# EAGLE design scoreur (EAGLE 6.6.0)
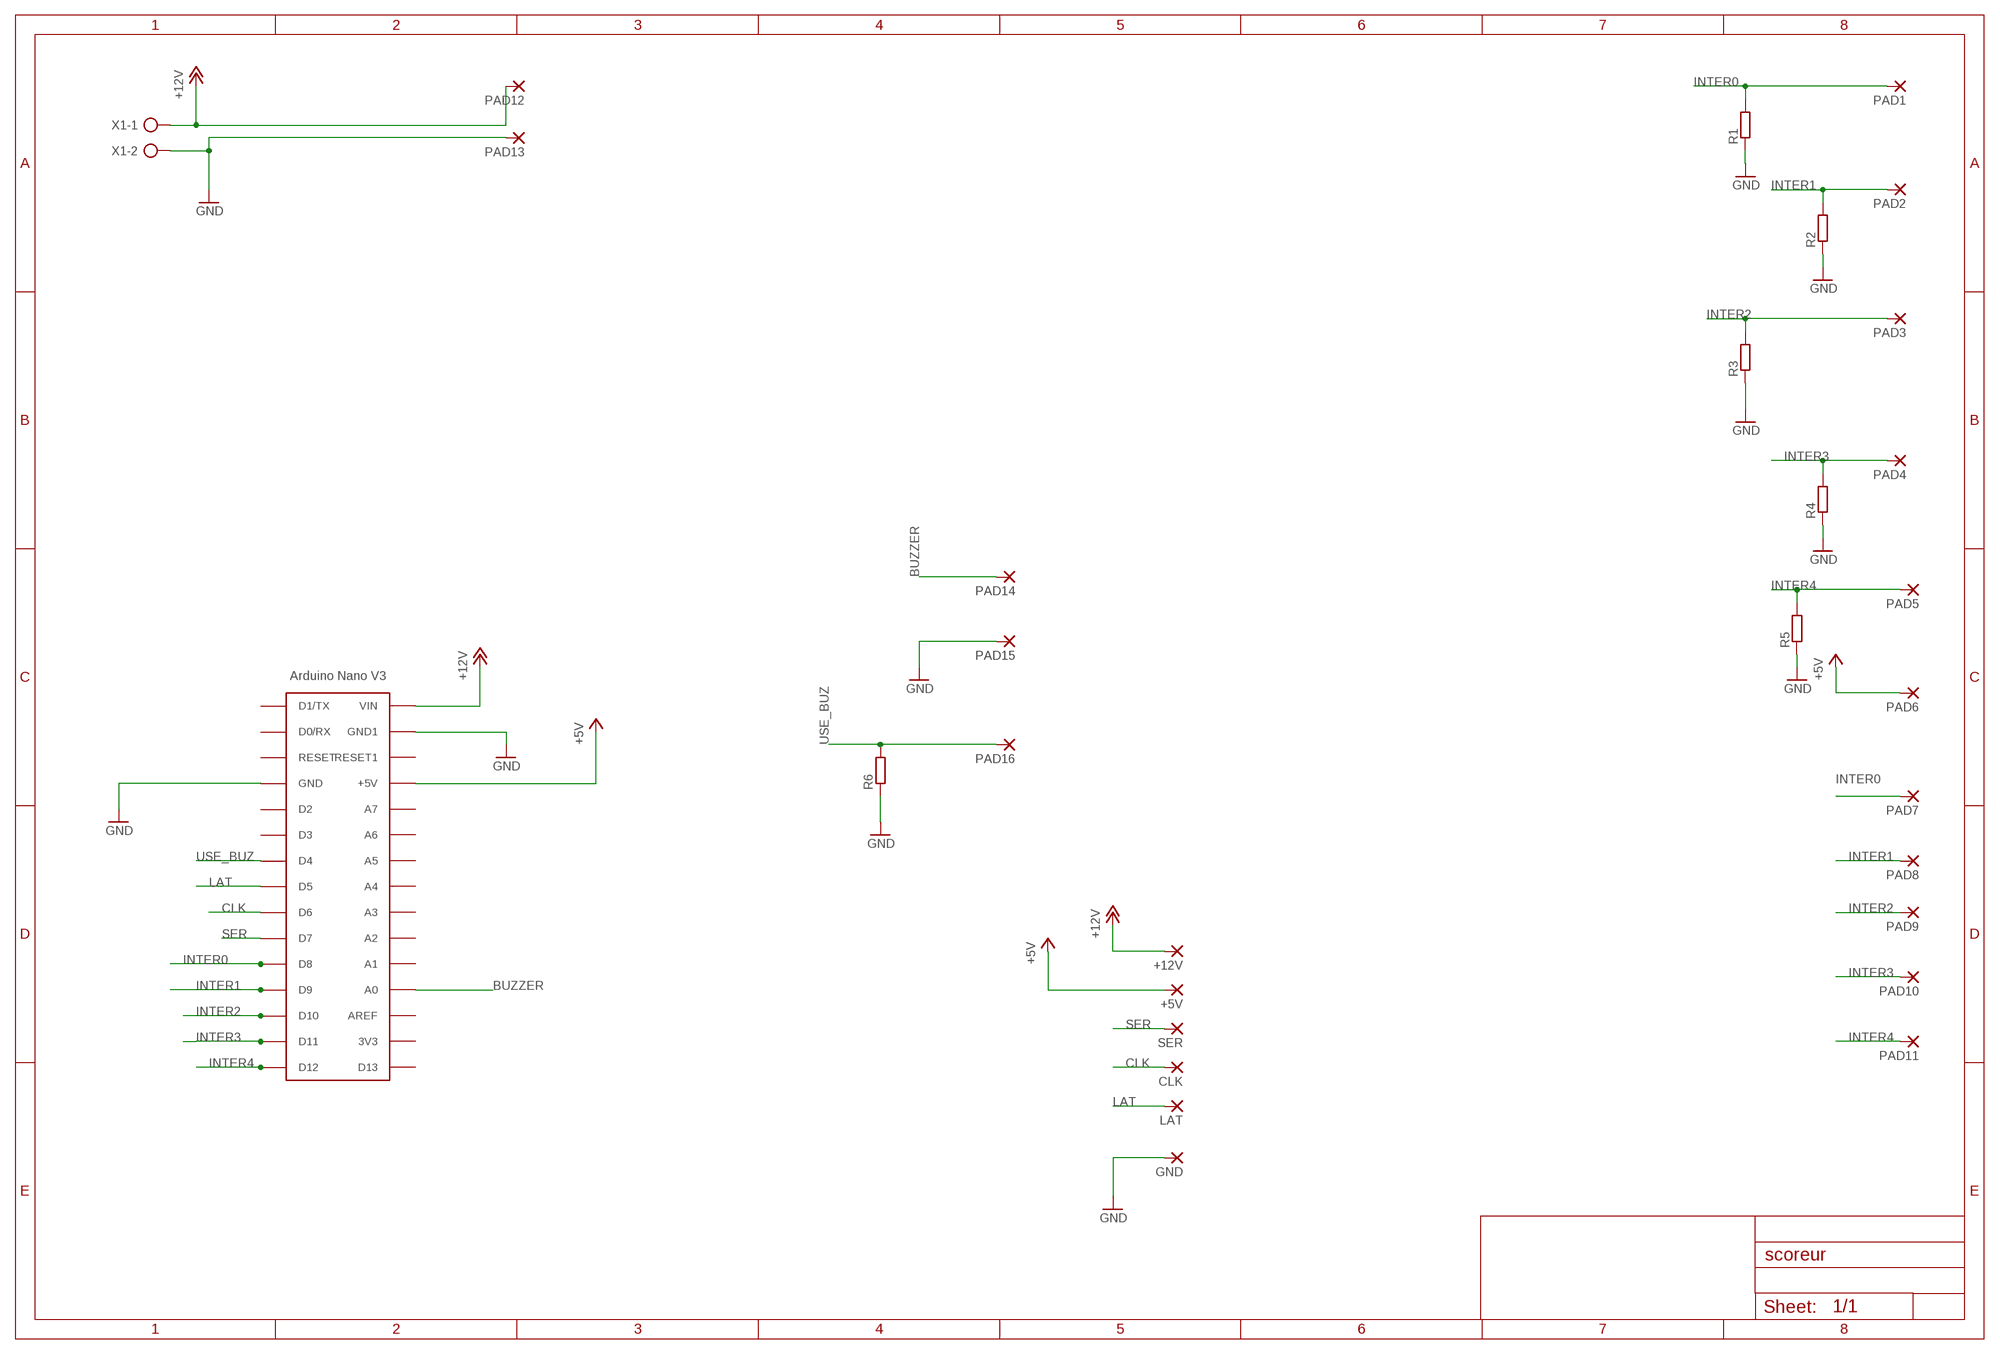
[diagram p0: schematic, sheet 1]

## Parts
+5V  SMD5  [SMD2,54-5,08]
+12V  SMD5  [SMD2,54-5,08]
CLK  SMD5  [SMD2,54-5,08]
GND  SMD5  [SMD2,54-5,08]
LAT  SMD5  [SMD2,54-5,08]
PAD1  SMD5  [SMD2,54-5,08]
PAD2  SMD5  [SMD2,54-5,08]
PAD3  SMD5  [SMD2,54-5,08]
PAD4  SMD5  [SMD2,54-5,08]
PAD5  SMD5  [SMD2,54-5,08]
PAD6  SMD5  [SMD2,54-5,08]
PAD7  SMD5  [SMD2,54-5,08]
PAD8  SMD5  [SMD2,54-5,08]
PAD9  SMD5  [SMD2,54-5,08]
PAD10  SMD5  [SMD2,54-5,08]
PAD11  SMD5  [SMD2,54-5,08]
PAD12  SMD5  [SMD2,54-5,08]
PAD13  SMD5  [SMD2,54-5,08]
PAD14  SMD5  [SMD2,54-5,08]
PAD15  SMD5  [SMD2,54-5,08]
PAD16  SMD5  [SMD2,54-5,08]
R1  R-EU_R1206  [R1206]
R2  R-EU_R1206  [R1206]
R3  R-EU_R1206  [R1206]
R4  R-EU_R1206  [R1206]
R5  R-EU_R1206  [R1206]
R6  R-EU_R1206  [R1206]
SER  SMD5  [SMD2,54-5,08]
U$1  ARDUINONANO  [PDIP-32]
X1  AK500/2-H  [AK500/2-H]

## Nets
+5V: +5V.1(P) PAD6.1(P) U$1.+5V
+12V: +12V.1(P) PAD12.1(P) U$1.VIN X1.1
BUZZER: PAD14.1(P) U$1.A7(A0)
CLK: CLK.1(P) U$1.D6
GND: GND.1(P) PAD13.1(P) PAD15.1(P) R1.1 R2.1 R3.1 R4.1 R5.1 R6.1 U$1.GND U$1.GND1 X1.2
INTER0: PAD1.1(P) PAD7.1(P) R1.2 U$1.D8
INTER1: PAD2.1(P) PAD8.1(P) R2.2 U$1.D9
INTER2: PAD3.1(P) PAD9.1(P) R3.2 U$1.D10
INTER3: PAD4.1(P) PAD10.1(P) R4.2 U$1.D11
INTER4: PAD5.1(P) PAD11.1(P) R5.2 U$1.D12
LAT: LAT.1(P) U$1.D5
SER: SER.1(P) U$1.D7
USE_BUZ: PAD16.1(P) R6.2 U$1.D4
Unconnected: U$1.3V3 U$1.A0(A7) U$1.A1(A6) U$1.A2(A5) U$1.A3(A4) U$1.A4(A3) U$1.A5(A2) U$1.A6(A1) U$1.AREF U$1.D0/RX U$1.D1/TX U$1.D2 U$1.D3 U$1.D13 U$1.RESET U$1.RESET1

## Library data of the parts
+5V +12V CLK GND LAT PAD1-PAD16 SER = wirepad:SMD5: SMD PAD
R1-R6 = rcl:R-EU_: RESISTOR, European symbol
U$1 = CRE-Lib1:ARDUINONANO: Arduino Nano
X1 = con-ptr500:AK500/2-H: CONNECTOR Aug. 2004 / PTR Meßtechnik: Die Bezeichnung der Serie AK505 wurde geändert. Es handelt sich hierbei um AK500 in horizontaler Ausführung.; OC_FARNELL: unknown; OC_NEWARK: unknown

## Board
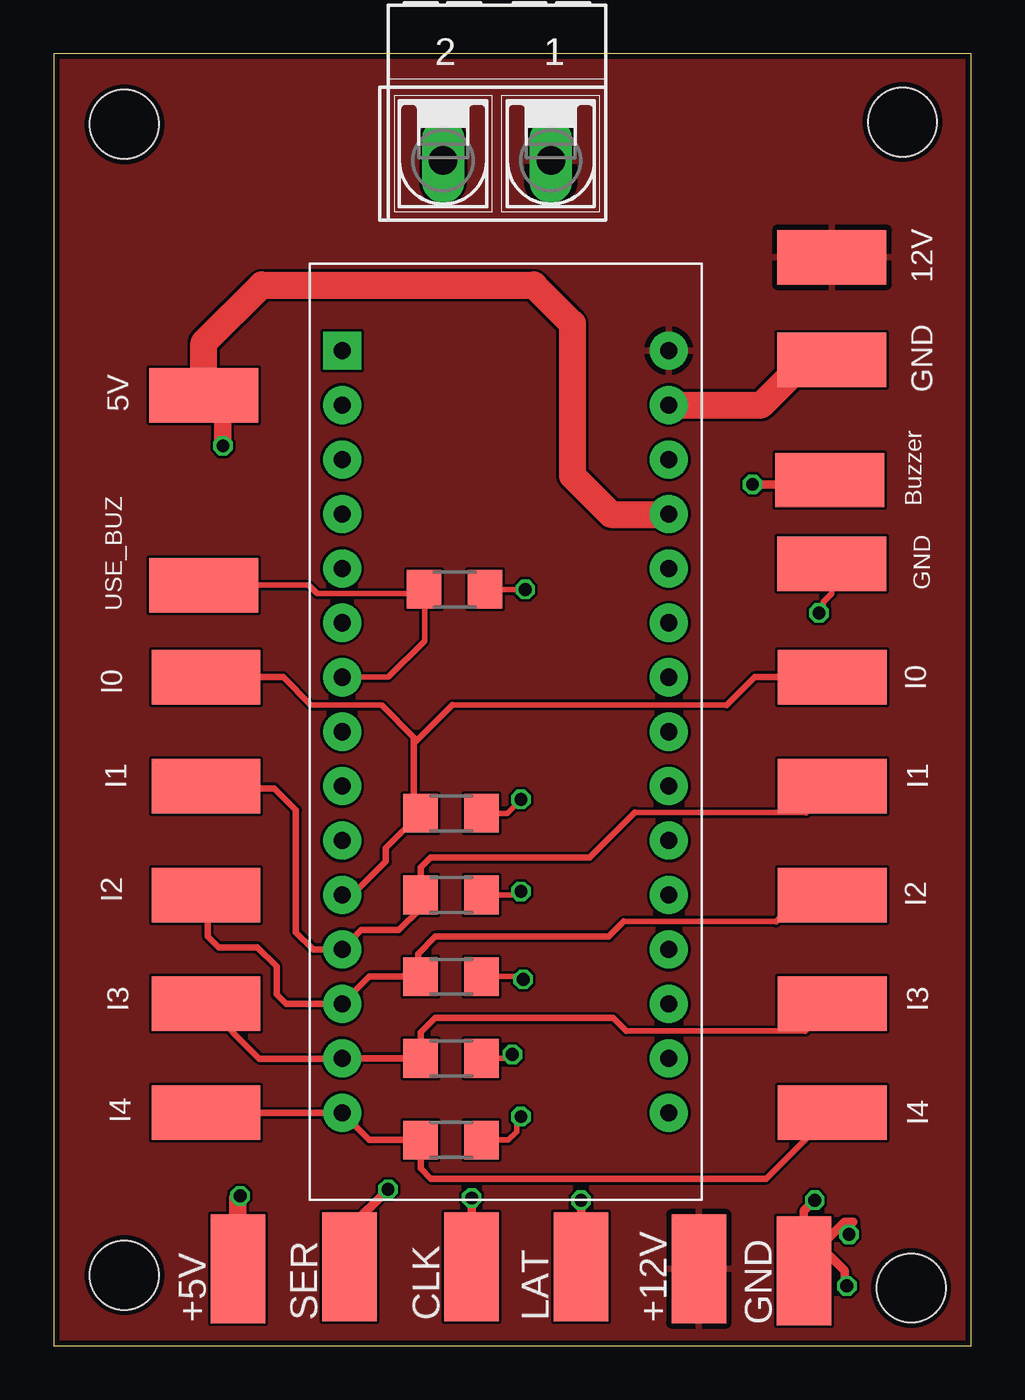
[diagram p1: board, top side]
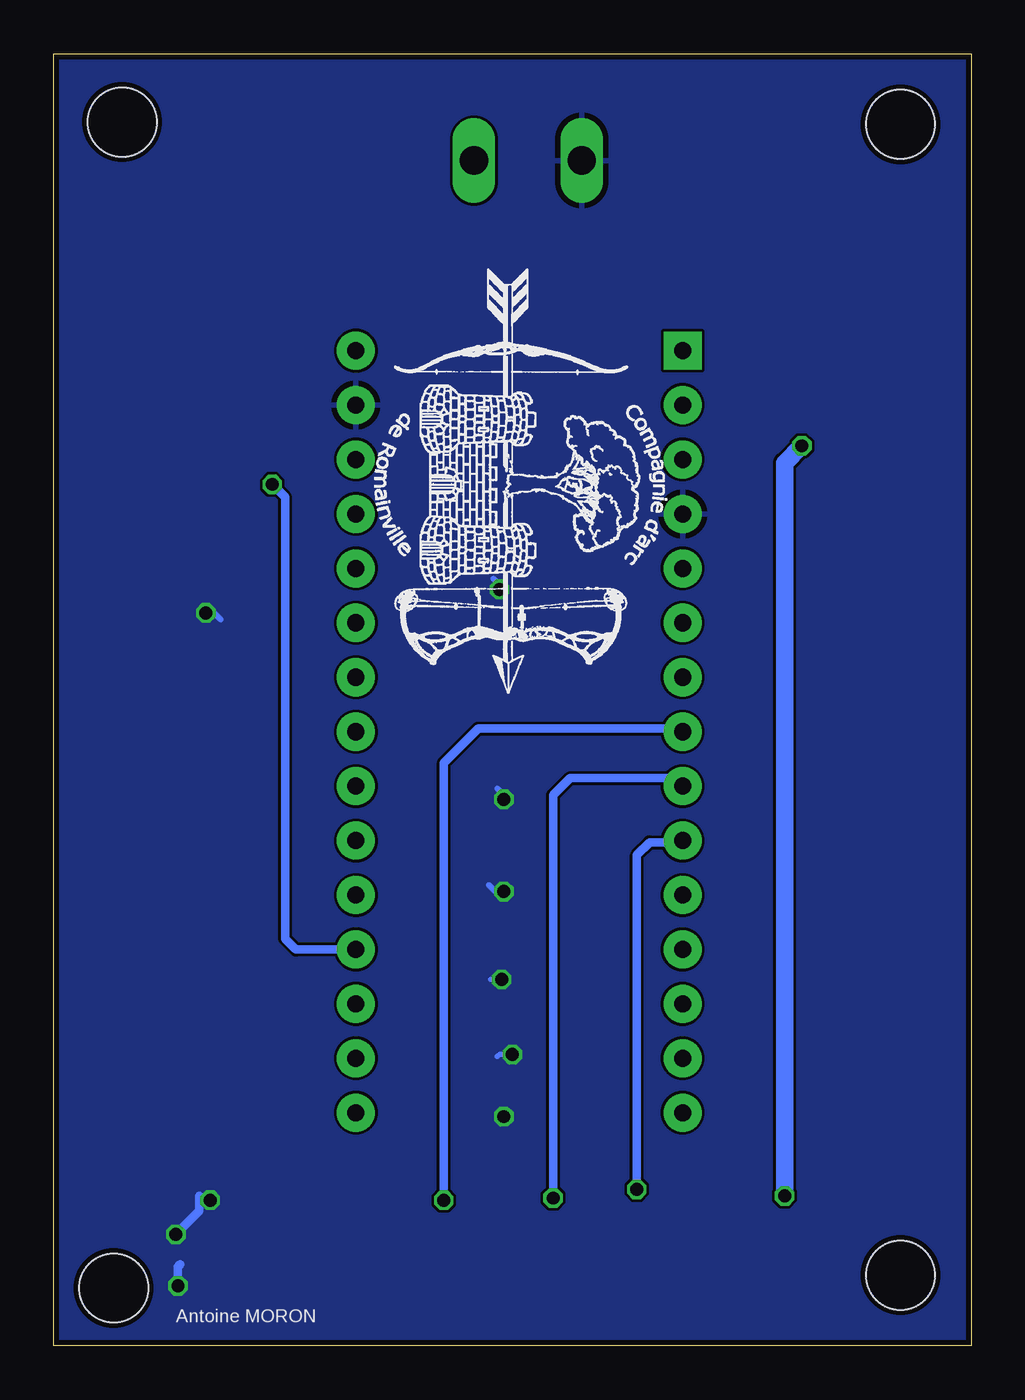
[diagram p2: board, bottom side, seen from below]

Size 42.8 x 60.3 mm. Coordinates in mm from the lower left corner, seen from the top.
Outline: 0,0 42.8,0 42.8,60.3 0,60.3 0,0
Copper layers (1*16): Top 0.035mm / dielectric 1.5mm / Bottom 0.035mm
Design rules "dirt_cheap_dirty_boards.v1": minimum track width 5mil, minimum drill 12mil, track to track 5mil, track to pad 5mil, pad to pad 5mil, via to via 5mil, smd to smd 0mil, copper to edge 10mil, drill to drill 10mil, minimum pad ring 10mil, minimum via ring 6mil, stop-mask expansion 2mil, vias tented up to drill 25mil, thermal gap 10mil
Holes 3.2 mm at 3.3,57 39.6,57.1 40,2.7 3.3,3.3

### Footprints (pad centres in the part's own frame; a part is rotated, then mirrored left to right if it is on the bottom)
SMD2,54-5,08 = smd 2.54 x 5.08: 1 0,0
R1206 = smd 1.6 x 1.803: 1 -1.422,0; 2 1.422,0
PDIP-32 = drill 0.8 pad 1.778: 3V3 15.24,-35.56; +5V 15.24,-10.16; A0 15.24,-12.7; A1 15.24,-15.24; A2 15.24,-17.78; A3 15.24,-20.32; A4 15.24,-22.86; A5 15.24,-25.4; A6 15.24,-27.94; A7 15.24,-30.48; AREF 15.24,-33.02; D0/RX 0,-5.08; D2 0,-12.7; D3 0,-15.24; D4 0,-17.78; D5 0,-20.32; D6 0,-22.86; D7 0,-25.4; D8 0,-27.94; D9 0,-30.48; D10 0,-33.02; D11 0,-35.56; D12 0,-38.1; D13 15.24,-38.1; GND 0,-10.16; GND1 15.24,-5.08; RESET 0,-7.62; RESET1 15.24,-7.62; VIN 15.24,-2.54 | drill 0.8 pad 1.778 square: D1/TX 0,-2.54
AK500/2-H = drill 1.321 long: 1 -2.515,0; 2 2.515,0

### Placement (x,y rotation side)
+5V  8.6,3.6 0 top
+12V  30.1,3.6 0 top
CLK  19.5,3.7 0 top
GND  35,3.5 0 top
LAT  24.6,3.7 0 top
PAD1  7.11,31.2 90 top
PAD2  7.11,26.12 90 top
PAD3  7.11,21.04 90 top
PAD4  7.11,15.96 90 top
PAD5  36.32,10.88 90 top
PAD6  7.01,44.35 90 top
PAD7  36.32,31.2 90 top
PAD8  36.32,26.12 90 top
PAD9  36.32,21.04 90 top
PAD10  36.32,15.96 90 top
PAD11  7.11,10.88 90 top
PAD12  36.3,50.8 90 top
PAD13  36.3,46 90 top
PAD14  36.2,40.4 90 top
PAD15  36.3,36.5 90 top
PAD16  7,35.5 90 top
R1  18.54,24.85 180 top
R2  18.54,21.04 180 top
R3  18.54,17.23 180 top
R4  18.54,13.42 180 top
R5  18.54,9.61 180 top
R6  18.7,35.3 180 top
SER  13.8,3.7 0 top
U$1  13.46,48.98 0 top
U$2  [LOGO]  28.4,50.6 270 bottom
X1  20.68,55.31 180 top

### Tracks (layer width: path | path; a pad name or v marks a point on that pad's centre or on a via)
+5V  (via drill 0.6)
  Top 0.813: +5V.1 8.6,6.9 v8.7,7 | v7.9,42 7.9,44.6 7.8,44.7 7.36,44.7 PAD6.1
  Top 1.27: PAD6.1 7.01,46.81 9.7,49.5 22.4,49.5 24.2,47.7 24.2,40.6 26,38.8 28.68,38.8 U$1.+5V
  Bottom 0.813: v8.7,7 8.7,41.2 v7.9,42
+12V
  pour Top: 0.1,61.9 46,62.2 45.7,-0.1 0,-0.1
BUZZER  (via drill 0.6)
  Top 0.406: v32.6,40.2 36,40.2 PAD14.1
  Bottom 0.406: U$1.A7 31.5,18.5 32,19 32,39.6 v32.6,40.2
CLK  (via drill 0.6)
  Top 0.406: CLK.1 v19.5,6.9
  Bottom 0.406: v19.5,6.9 19.5,25.7 18.7,26.5 13.84,26.5 U$1.D6
GND  (via drill 0.6)
  Top 0.254: R6.1 v22,35.3 | R1.1 21.15,24.85 v21.8,25.5 | R2.1 21.64,21.04 v21.8,21.2 | R3.1 21.77,17.23 v21.9,17.1 | R4.1 21.22,13.42 v21.4,13.6 | PAD15.1 36.3,35.1 35.9,34.7 35.9,34.4 v35.7,34.2 | R5.1 21.21,9.61 21.6,10 21.6,10.5 v21.8,10.7
  Top 0.406: GND.1 35,6.3 v35.5,6.8 | v37.1,5.2 37.1,5.6 37.3,5.8 36.9,5.8 35.3,4.2 36.2,4.2 36.9,3.5 36.9,2.9 v37,2.8
  Top 1.27: U$1.GND1 33,43.9 34.7,45.6 35.9,45.6 PAD13.1
  Bottom 0.254: v22,35.3 22,35.5 22.3,35.8 | v21.8,25.5 21.8,25.7 22.1,26 | v21.8,21.2 22.2,21.2 22.5,21.5 | v21.9,17.1 22.4,17.1 | v21.4,13.6 22,13.6 22.1,13.5 | v35.7,34.2 35.3,34.2 35,33.9 | v21.8,10.7 21.7,10.8
  Bottom 0.406: v35.5,6.8 35.8,6.8 36,7 36,6.3 v37.1,5.2 | v37,2.8 37,3.7 36.9,3.8
  pour Bottom: 0.2,60.4 43.5,60.4 43.5,-1.9 0,-1.9 0,60.4
INTER0
  Top 0.254: 10.7,31.2 12,29.9 15.3,29.9 16.8,28.4 | 31.4,29.9 18.6,29.9
  Top 0.305: PAD1.1 10.7,31.2 | 16.8,28.4 16.8,28.1 | 16.8,28.1 16.8,25.17 R1.2 15.5,23.23 15.5,22.6 13.94,21.04 U$1.D8 | PAD7.1 32.7,31.2 31.4,29.9 | 18.6,29.9 16.8,28.1
INTER1
  Top 0.254: 27.1,24.9 35.1,24.9
  Top 0.305: PAD2.1 7.23,26 10.3,26 11.3,25 11.3,19.3 12.1,18.5 U$1.D9 14.36,19.4 16.1,19.4 17.12,20.42 R2.2 17.12,22.32 17.6,22.8 25,22.8 27.1,24.9 | 35.1,24.9 PAD8.1
INTER2
  Top 0.254: 33.7,19.8 26.6,19.8
  Top 0.305: PAD9.1 34.94,21.04 33.7,19.8 | 26.6,19.8 25.9,19.1 17.8,19.1 17,18.3 17,17.35 R3.2 14.73,17.23 U$1.D10 10.84,15.96 10.4,16.4 10.4,17.7 9.5,18.6 7.7,18.6 7.2,19.1 7.2,20.95 PAD3.1
INTER3
  Top 0.254: 26.7,14.7 35.06,14.7
  Top 0.305: 26.7,14.7 26.1,15.3 17.8,15.3 17.12,14.62 R4.2 U$1.D11 13.44,13.4 9.6,13.4 7.11,15.89 PAD4.1 | 35.06,14.7 PAD10.1
INTER4
  Top 0.305: PAD5.1 33.24,7.8 17.6,7.8 17.12,8.28 R5.2 14.73,9.61 U$1.D12 PAD11.1
LAT  (via drill 0.6)
  Top 0.406: LAT.1 v24.6,6.8
  Bottom 0.406: v24.6,6.8 24.6,27.2 23,28.8 13.6,28.8 U$1.D5
SER  (via drill 0.6)
  Top 0.406: SER.1 13.8,5.5 v15.6,7.3
  Bottom 0.406: v15.6,7.3 15.6,22.9 15,23.5 13.54,23.5 U$1.D7
USE_BUZ
  Top 0.254: U$1.D4 15.6,31.2 17.3,32.9 17.3,35.28 R6.2 17.08,35.1 12.3,35.1 11.9,35.5 PAD16.1

### Text on the board
tNames: 12V | 5V | GND | Buzzer | GND | USE_BUZ | I0 | I0 | I1 | I1 | I2 | I2 | I3 | I3 | I4 | I4
bNames: Antoine MORON
tValues: OUT | IN